# EAGLE design EEGAmp_SMT_MountHole (EAGLE 9.6.2)
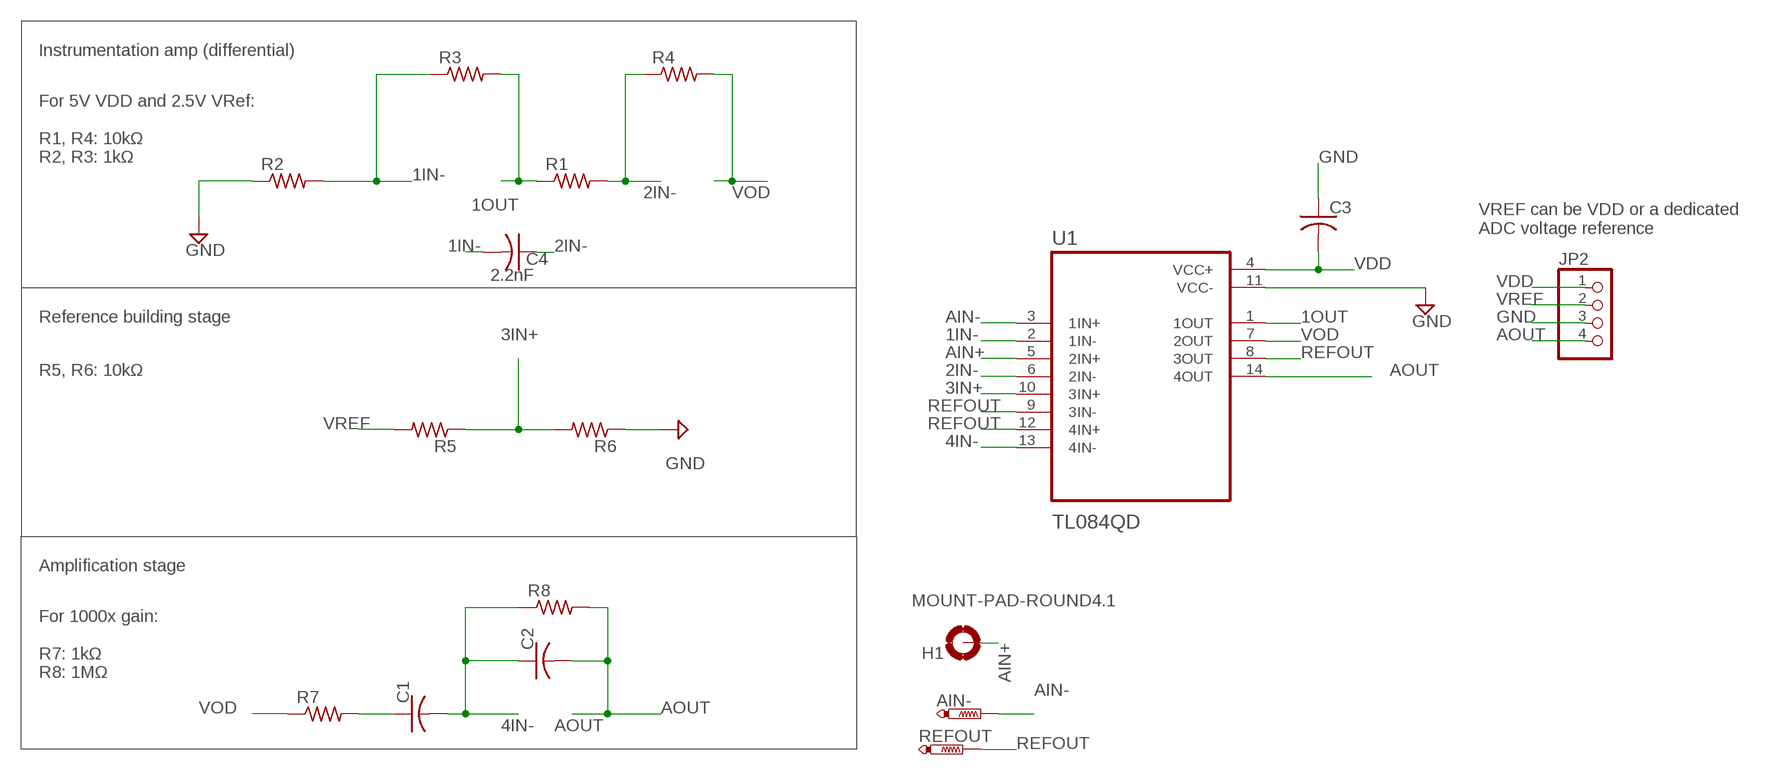
[diagram p0: schematic, sheet 1]

## Parts
AIN-  PTR1PAD1-17  [P1-17]
C1  C-USC0402  [C0402]
C2  C-USC0402  [C0402]
C3  C-USC0402  [C0402]
C4  2.2nF  C-USC0402  [C0402]
H1  MOUNT-PAD-ROUND4.1  [4,1-PAD]
JP2  PINHD-1X4  [1X04]
R1  R-US_R0402  [R0402]
R2  R-US_R0402  [R0402]
R3  R-US_R0402  [R0402]
R4  R-US_R0402  [R0402]
R5  R-US_R0402  [R0402]
R6  R-US_R0402  [R0402]
R7  R-US_R0402  [R0402]
R8  R-US_R0402  [R0402]
REFOUT  PTR1PAD1-17  [P1-17]
U1  TL084QD  [SOIC127P600X175-14N]

## Nets
1IN-: C4.2 R2.2 R3.1 U1.2(1IN-)
1OUT: R1.1 R3.2 U1.1(1OUT)
2IN-: C4.1 R1.2 R4.1 U1.6(2IN-)
3IN+: R5.1 R6.2 U1.10(3IN+)
4IN-: C1.2 C2.1 R8.1 U1.13(4IN-)
AIN+: H1.B4,1(MOUNT) U1.5(2IN+)
AIN-: AIN-.TP U1.3(1IN+)
AOUT: C2.2 JP2.4 R8.2 U1.14(4OUT)
GND: C3.1 JP2.3 R2.1 R6.1 U1.11(VCC-)
N$9: C1.1 R7.2
REFOUT: REFOUT.TP U1.8(3OUT) U1.9(3IN-) U1.12(4IN+)
VDD: C3.2 JP2.1 U1.4(VCC+)
VOD: R4.2 R7.1 U1.7(2OUT)
VREF: JP2.2 R5.2

## Notes on the sheet
- Instrumentation amp (differential)
- For 5V VDD and 2.5V VRef:
  
  R1, R4: 10kΩ
  R2, R3: 1kΩ
- VREF can be VDD or a dedicated
  ADC voltage reference
- Reference building stage
- R5, R6: 10kΩ
- Amplification stage
- For 1000x gain:
  
  R7: 1kΩ
  R8: 1MΩ

## Library data of the parts
AIN- REFOUT = testpad:PTR1: TEST PIN
C1-C4 = rcl:C-US: CAPACITOR, American symbol; SPICEPREFIX: C
H1 = holes:MOUNT-PAD-ROUND: MOUNTING PAD, round
JP2 = pinhead:PINHD-1X4: PIN HEADER
R1-R8 = rcl:R-US_: RESISTOR, American symbol; SPICEPREFIX: R
U1 = TL084QD:TL084QD: Check availability <https://pricing.snapeda.com/parts/TL084QD/Texas%20Instruments/view-part?ref=eda>; AVAILABILITY: In Stock; CHECK_PRICES: https://www.snapeda.com/parts/TL084QD/Texas+Instruments/view-part/?ref=eda; DESCRIPTION: Quad, 30-V, 3-MHz, 13-V/µs slew rate, In to V+, JFET-input op amp; MF: Texas Instruments; MP: TL084QD; PACKAGE: SOIC-14 Texas Instruments; PRICE: None; PURCHASE-URL: https://www.snapeda.com/api/url_track_click_mouser/?unipart_id=1136083&manufacturer=Texas Instruments&part_name=TL084QD&search_term=tl084; SNAPEDA_LINK: https://www.snapeda.com/parts/TL084QD/Texas+Instruments/view-part/?ref=snap

## Board
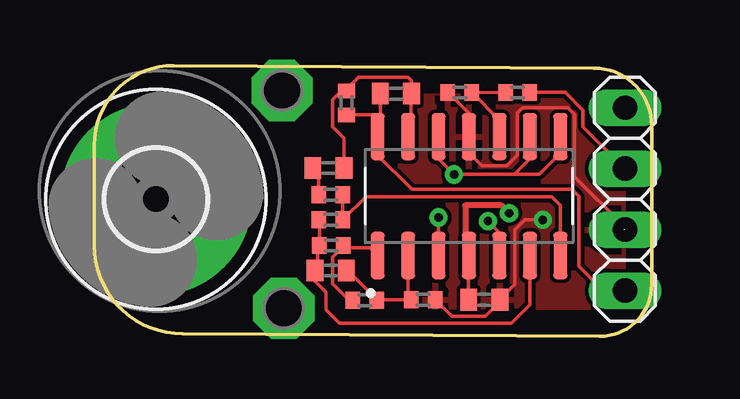
[diagram p1: board, top side]
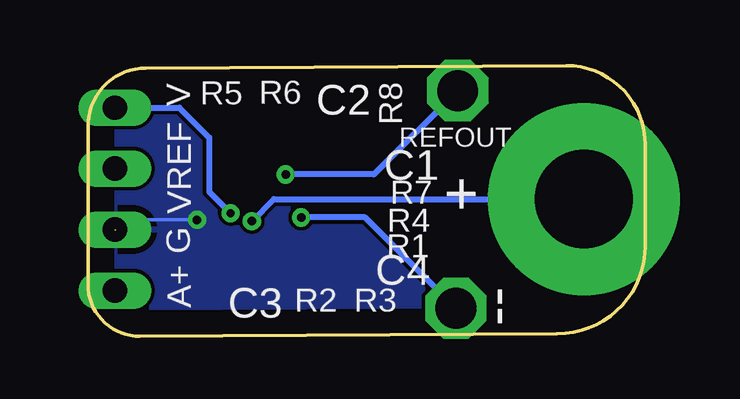
[diagram p2: board, bottom side, seen from below]

Size 23.24 x 11.28 mm. Coordinates in mm from the lower left corner, seen from the top.
Outline: 0,7.98 arc-90 3.3,11.28 20.83,11.18 arc-90 23.24,8.76 23.24,2.16 arc-90 21.08,0 3.68,0.1 arc-90 0,3.79 0,7.98
Copper layers (1*16): Top 0.035mm / dielectric 1.5mm / Bottom 0.035mm
Design rules "default": minimum track width 6mil, minimum drill 0.35mm, track to track 6mil, track to pad 6mil, pad to pad 6mil, via to via 6mil, smd to smd 6mil, copper to edge 40mil, drill to drill 6mil, minimum pad ring 10mil, minimum via ring 8mil, stop-mask expansion 4mil, vias tented up to drill 0mil, thermal gap 10mil

### Footprints (pad centres in the part's own frame; a part is rotated, then mirrored left to right if it is on the bottom)
P1-17 = drill 1.702 pad 2.54 octagon: TP 0,0
C0402 = smd 0.7 x 0.9: 1 -0.65,0; 2 0.65,0
4,1-PAD = drill 4.1 pad 8: B4,1 0,0
1X04 = drill 1.016 long: 1 -3.81,0; 2 -1.27,0; 3 1.27,0; 4 3.81,0
R0402 = smd 0.6 x 0.7: 1 -0.5,0; 2 0.5,0
SOIC127P600X175-14N = smd 1.97 x 0.6: 1 -2.475,3.81; 2 -2.475,2.54; 3 -2.475,1.27; 4 -2.475,0; 5 -2.475,-1.27; 6 -2.475,-2.54; 7 -2.475,-3.81; 8 2.475,-3.81; 9 2.475,-2.54; 10 2.475,-1.27; 11 2.475,0; 12 2.475,1.27; 13 2.475,2.54; 14 2.475,3.81

### Placement (x,y rotation side)
AIN-  7.9,1.17 90 top
C1  9.75,7.01 0 top
C2  12.57,10.11 180 top
C3  16.26,1.52 180 top
C4  9.86,2.74 0 top
H1  2.57,5.71 0 top
JP2  22.12,5.71 270 top
R1  9.88,3.78 180 top
R2  13.72,1.52 180 top
R3  11.28,1.5 180 top
R4  9.86,4.85 0 top
R5  17.65,10.16 0 top
R6  15.24,10.16 0 top
R7  9.86,5.89 180 top
R8  10.52,9.73 270 top
REFOUT  7.82,10.24 0 top
U1  15.62,5.84 90 top

### Tracks (layer width: path | path; a pad name or v marks a point on that pad's centre or on a via)
1IN-
  Top 0.152: U1.2 13.08,1.66 R2.2 11.78,1.52 | R3.1 11.78,1.52 | C4.2 10.56,2.74 11.78,1.52
1OUT
  Top 0.152: U1.1 11.49,3.69 10.48,3.69 R1.1 10.38,3.74 9.93,3.29 9.93,2.2 10.62,1.51 10.77,1.51 R3.2
2IN-
  Top 0.152: U1.6 18.16,1.32 17.38,0.54 10.22,0.54 9.66,1.1 9.66,1.83 9.21,2.28 C4.1 9.3,2.84 9.3,3.71 R1.2 9.38,4.83 R4.1
3IN+
  Top 0.152: R5.1 R6.2 16.89,9.01 U1.10
4IN-
  Top 0.152: U1.13 13.21,8.44 13.21,10.11 C2.1 13.22,10.64 13.07,10.8 11.01,10.8 10.52,10.3 R8.1 10.31,10.23 9.93,9.85 9.93,8.73 10.4,8.25 C1.2
AIN+  (via drill 0.35)
  Top 0.152: v16.41,4.8 16.89,4.32 U1.5
  Bottom 0.254: v16.41,4.8 15.49,5.71 H1.B4,1
AIN-  (via drill 0.35)
  Top 0.152: v14.35,4.95 U1.3
  Bottom 0.254: AIN-.TP 11.68,4.95 v14.35,4.95
AOUT
  Top 0.152: C2.2 11.92,9.09 | 11.92,9.09 11.92,8.43 U1.14 11.81,7.54 13.23,6.12 19.91,6.12 20.19,5.84 20.19,2.92 21.21,1.91 JP2.4 | 11.92,9.09 11.79,9.23 R8.2
GND  (via drill 0.35)  (1 unrouted)
  Top 0.152: R2.1 14.91,0.84 16.3,0.84 16.91,1.45 C3.1 17.54,2.16 17.54,4.44 17.96,4.85 v18.69,4.85 | 14.74,10.26 R6.1 15.63,9.27 U1.11 15.62,7.64 16.15,7.1 17.2,7.1 17.63,7.54 17.63,9.31 17.85,9.53 19.74,9.53 20.02,9.25 20.02,6.66 22.07,4.6 22.07,4.45
  Top 0.254: U1.11 15.62,7.79
  Bottom 0.152: v18.69,4.85 21.71,4.85 JP2.3
  pour Bottom: 29.21,13.72 29.21,-2.29 -1.02,-2.29 -1.02,13.72
  pour Top: -1.02,13.34 28.96,13.34 28.96,-1.91 -1.02,-1.91
N$9
  Top 0.152: C1.1 9.36,6.76 R7.2
REFOUT  (via drill 0.35)
  Top 0.152: U1.12 14.35,7.39 v15,6.74 v15,6.75 17.52,6.75 | U1.9 18.16,7.39 17.52,6.75 | 17.52,6.75 18.55,6.75 19.43,7.63 U1.8
  Bottom 0.254: REFOUT.TP 11.32,6.74 v15,6.74
VDD  (via drill 0.35)
  Top 0.152: C3.2 15.61,3.35 U1.4 15.65,3.39
  Top 0.254: U1.4 15.47,3.52 15.47,5.46 16.96,5.46 v17.3,5.13
  Bottom 0.254: JP2.1 19.43,9.52 18.18,8.28 18.18,6.02 v17.3,5.13
VOD
  Top 0.152: R7.1 R4.2 11.32,5.82 19.07,5.82 19.43,5.46 U1.7
VREF
  Top 0.152: R5.2 19.63,10.16 20.37,9.42 20.37,8.74 JP2.2

### Text on the board
bNames: V | + | VREF | G | A+ | --